# Altium schematic sheet CurrentSrc.SchDoc
size 420 x 297 mm; Address1: Address1; Address2: Address2; Address3: Address3; Address4: Address4; SheetNumber: 1; Scale: 1:1; Разраб.: Иванов; Обозначение документа: Current Srcs; Пров.: Петров; Утв.: Сидоров; Наименование организации: ОАО "Концерн "МПО-Гидроприбор"; Перв. применение: АБВГ.123456.000; Наименование изделия 1: Плата; Наименование изделия 2: Схема электрическая; Наименование изделия 3: принципиальная; Нач. отд.: Нач. отд.; Фамилия нач. отд.: Сидоров
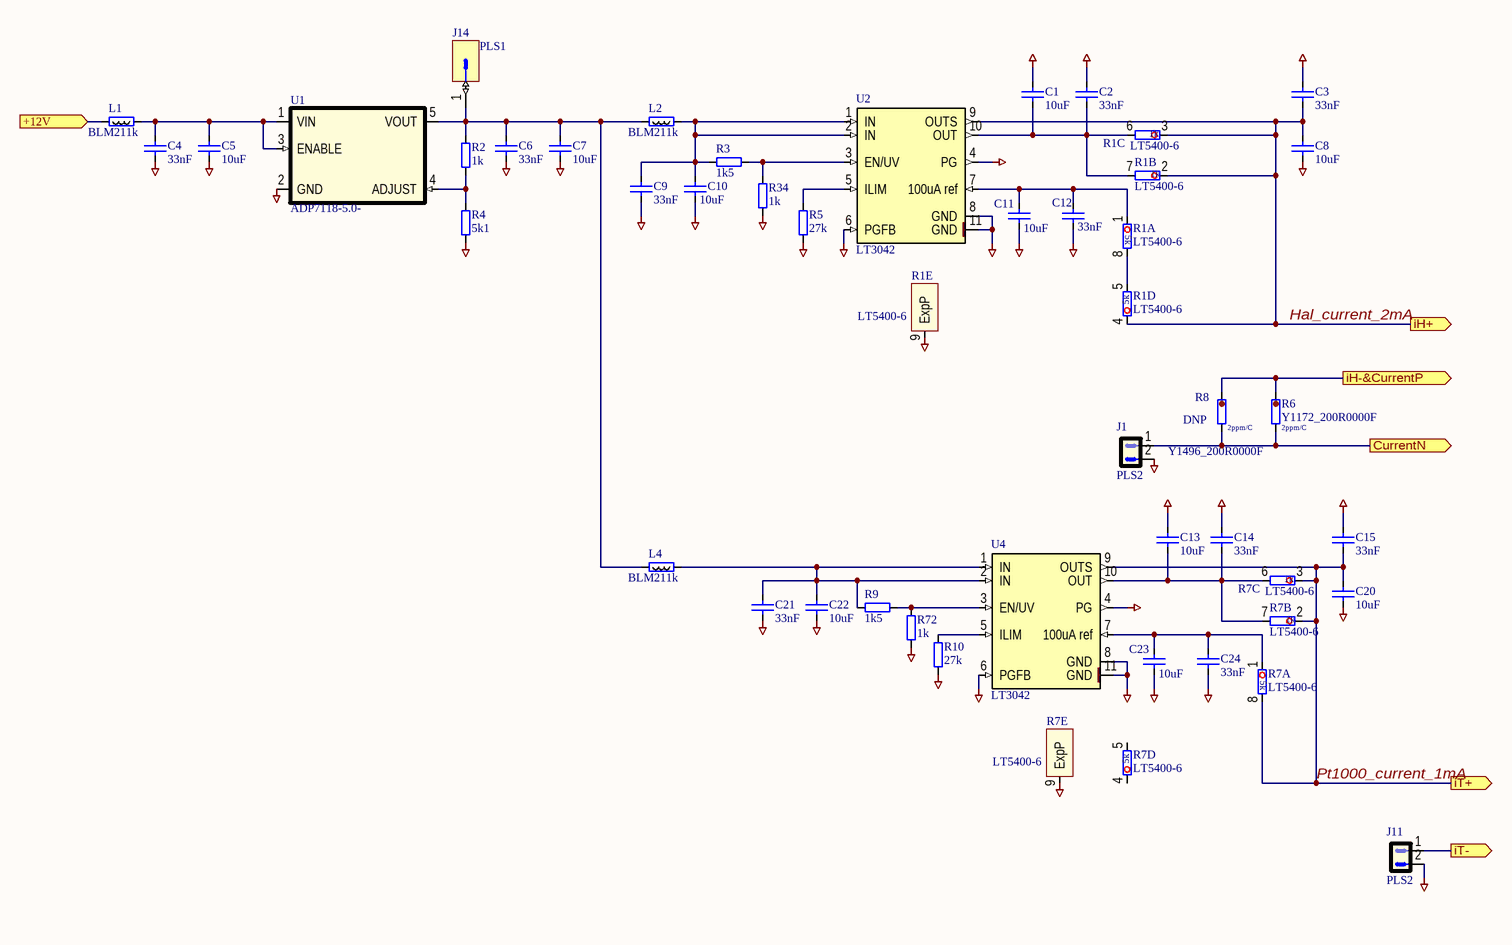
[diagram p0: CurrentSrc.SchDoc]

## Parts
C1  10uF  [SMD0805CAP]
C2  33nF  [SMD0805CAP]
C3  33nF  [SMD0805CAP]
C4  33nF  [SMD0805CAP]
C5  10uF  [SMD0805CAP]
C6  33nF  [SMD0805CAP]
C7  10uF  [SMD0805CAP]
C8  10uF  [SMD0805CAP]
C9  33nF  [SMD0805CAP]
C10  10uF  [SMD0805CAP]
C11  10uF  [SMD0805CAP]
C12  33nF  [SMD0805CAP]
C13  10uF  [SMD0805CAP]
C14  33nF  [SMD0805CAP]
C15  33nF  [SMD0805CAP]
C20  10uF  [SMD0805CAP]
C21  33nF  [SMD0805CAP]
C22  10uF  [SMD0805CAP]
C23  10uF  [SMD0805CAP]
C24  33nF  [CAPC1608X87N]
J1  PLS2  [PLS2]
J11  PLS2  [PLS2]
J14  PLS1  [PLS1]
L1  BLM211k  [RESC2012X50N]
L2  BLM211k  [RESC2012X50N]
L4  BLM211k  [RESC2012X50N]
R1  LT5400-6  [SOP65P488X110-9N-R178X241]  (parts A,B,C,D,E of 5)
R2  1k  [SMD0805RES]
R3  1k5  [SMD0805RES]
R4  5k1  [SMD0805RES]
R5  27k  [SMD0805RES]
R6  Y1172_200R0000F  TC: 2ppm/C  [SMD0805RES]
R7  LT5400-6  [SOP65P488X110-9N-R178X241]  (parts A,B,C,D,E of 5)
R8  Y1496_200R0000F  Solder Option: DNP  TC: 2ppm/C  [RESC3016X65N]
R9  1k5  [SMD0805RES]
R10  27k  [SMD0805RES]
R34  1k  [SMD0805RES]
R72  1k  [SMD0805RES]
U1  ADP7118-5.0-  [SOT23-5]
U2  LT3042  [SOP50P490X110-11N-R157X188]
U4  LT3042  [SOP50P490X110-11N-R157X188]

## Ports
+12V (in), CurrentN (out), iH+ (out), iH-&CurrentP (out), iT+ (out), iT- (out)

## Nets
GND: C1.2 C2.2 C3.1 C4.1 C5.1 C6.1 C7.1 C8.1 C9.1 C10.1 C11.1 C12.1 C13.2 C14.2 C15.1 C20.1 C21.1 C22.1 C23.1 C24.1 J1.2 J11.2 R1.9(ExpP) R4.1 R5.1 R7.9(ExpP) R10.1 R34.1 R72.1 U1.2(GND) U2.4(PG) U2.6(PGFB) U2.8(GND) U2.11(GND) U4.4(PG) U4.6(PGFB) U4.8(GND) U4.11(GND)
+12V: L1.1 ; port +12V
CurrentN: J1.1 R6.1 R8.1 ; port CurrentN
Hal_current_2mA: C3.2 C8.2 R1.2 R1.3 R1.4 U2.9(OUTS) ; port iH+
iH-&CurrentP: R6.2 R8.2 ; port iH-&CurrentP
iT-: J11.1 ; port iT-
Pt1000_current_1mA: C15.2 C20.2 R7.2 R7.3 R7.8 U4.9(OUTS) ; port iT+
NetC1_1: C1.1 C2.1 R1.6 R1.7 U2.10(OUT)
NetC4_2: C4.2 C5.2 L1.2 U1.1(VIN) U1.3(ENABLE)
NetC6_2: C6.2 C7.2 J14.1 L2.1 L4.1 R2.2 U1.5(VOUT)
NetC9_2: C9.2 C10.2 L2.2 R3.1 U2.1(IN) U2.2(IN)
NetC11_2: C11.2 C12.2 R1.1 U2.7(100uA_ref)
NetC13_1: C13.1 C14.1 R7.6 R7.7 U4.10(OUT)
NetC21_2: C21.2 C22.2 L4.2 R9.1 U4.1(IN) U4.2(IN)
NetC23_2: C23.2 C24.2 R7.1 U4.7(100uA_ref)
NetR1_5: R1.5 R1.8
NetR2_1: R2.1 R4.2 U1.4(ADJUST)
NetR3_2: R3.2 R34.2 U2.3(EN/UV)
NetR5_2: R5.2 U2.5(ILIM)
NetR9_2: R9.2 R72.2 U4.3(EN/UV)
NetR10_2: R10.2 U4.5(ILIM)

Not connected (* = marked no-connect by the designer): R7 4 5

## Notes on the sheet
- Подп. и дата
- Инв. № дубл.
- Взам. инв. №
- Инв. № подл.
- Изм.
- Лист
- № докум.
- Подп.
- Дата
- Копировал
- Формат А3
- (in symbol LT5400, part A) 5k
- (in symbol LT5400, part B) 1k
- (in symbol LT5400, part C) 1k
- (in symbol LT5400, part D) 5k

## Library data of the parts
C1-C15 C20-C23 = C0805: Чип конденсатор 0805; Voltage: 25V; Vendor: Vishay; DielectricType: X5R; SMD Solders: 2; Solder Option: RM; Tolerance: 20%; Pkg: SMD0805; Device: Cap0805; Price: 2
  C1 C5 C7 C8 C10 C11 C13 C20 C22 C23: Value: 10uF
  C2-C4 C6 C9 C12 C14 C15 C21: Value: 33nF
C24 = C0805: Чип конденсатор 0603; Voltage: 50V; Vendor: Vishay; DielectricType: X5R; SMD Solders: 2; Solder Option: RM; Tolerance: 20%; Pkg: SMD0603; Device: Cap603; Value: 33nF; Price: 2
J1 J11 = PLS2: Vendor: Confly; SMD Solders: 0; Solder Option: RM; THD Solders: 2; Price: 1; Device: PLS2
J14 = PLS1: Штырь PLS1; Vendor: Confly; SMD Solders: 0; Solder Option: RM; THD Solders: 1; Price: 1; Device: PLS1
L1 L2 L4 = BLM21: SMD Ferrite bead 0805; Vendor: Vishay; Value: 1k; Pkg: SMD0805; SMD Solders: 2; Solder Option: RM; Price: 10; Device: BLM21
R1 R7 = LT5400: 4 прецизионных резистора; Vendor: Analog Devices; SMD Solders: 0; Solder Option: i; TC: 200ppb/C; Tolerance: 0..025%; Pkg: MSOP 9-0.65; Pwr: 40C/W; Name to order: LT5400BMPMS8E-6#PBF; Value: -6; Price: 2; Device: LT5400; THD Solders: 0
R2-R5 R9 R10 R34 R72 = R0805: Чип резистор 0805; Vendor: Vishay; SMD Solders: 2; Solder Option: RM; TC: 100ppm/C; Tolerance: 1%; Pkg: SMD0805; Pwr: 125mW; Device: Res0805; Price: 2
  R2 R34 R72: Value: 1k
  R3 R9: Value: 1k5
  R4: Value: 5k1
  R5 R10: Value: 27k
R6 = Y1172: Прецизионный чип резистор 0805; Vendor: Vishay; SMD Solders: 2; Solder Option: RM; Tolerance: 1%; Pkg: SMD0805; Pwr: 125mW; Name to order: Y1172200R0000xxx; Price: 2; Value: 200R0000F; Device: Y1172
R8 = Y1496: Прецизионный чип резистор 1206; Vendor: Vishay; SMD Solders: 2; Tolerance: 1%; Pkg: SMD1206; Pwr: 125mW; Name to order: Y1172200R0000xxx; Price: 2; Value: 200R0000F; Device: Y1496
U1 = ADP7118: Positive LDO Linear stabilizer; Vendor: Analog Devoces; Value: -5.0-; SMD Solders: 5; Solder Option: RM; Name to order: ADP7118AUJZ-5.0-R7; Pkg: SOT23-5; Price: 100; Device: ADP7118
U2 U4 = LT3042: Current source v 100uA ref; Name to order: LT3042EMSE; Pkg: MSOP10 PowPad; SMD Solders: 11; Solder Option: DiY; TC: 10ppm/C; THD Solders: 0; Tolerance: 1%; Vendor: Analog Devices Inc; Voltage: max 20V; Current: 200ma; Price: 1200; Device: LT3042